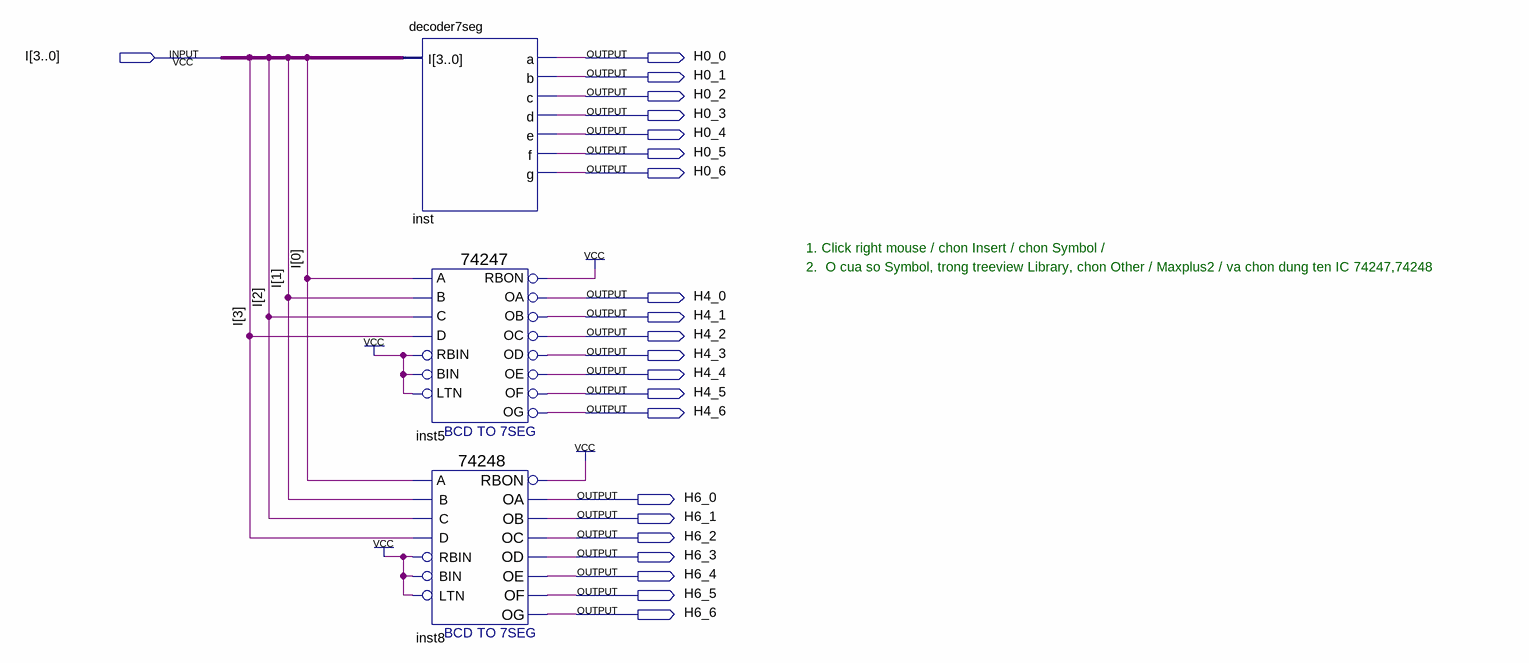
[diagram p0: schematic sheet]
// Quartus schematic topdesign.bdf as structural Verilog: 3 symbols, 22 pins
module topdesign (
  input  [3:0] I,
  output H0_0,
  output H0_1,
  output H0_2,
  output H0_3,
  output H0_4,
  output H0_5,
  output H0_6,
  output H4_0,
  output H4_1,
  output H4_2,
  output H4_3,
  output H4_4,
  output H4_5,
  output H4_6,
  output H6_0,
  output H6_1,
  output H6_2,
  output H6_3,
  output H6_4,
  output H6_5,
  output H6_6
);

  wire inst5_rbon, inst8_rbon;

  decoder7seg inst (.I(I), .a(H0_0), .b(H0_1), .c(H0_2), .d(H0_3), .e(H0_4), .f(H0_5), .g(H0_6));
  \74247  inst5 (
    .LTN(1'b1), .BIN(1'b1), .A(I[0]), .B(I[1]), .RBIN(1'b1), .C(I[2]), .D(I[3]), .OF(H4_5), .OC(H4_2),
    .OD(H4_3), .OE(H4_4), .RBON(inst5_rbon), .OA(H4_0), .OB(H4_1), .OG(H4_6));
  \74248  inst8 (
    .A(I[0]), .B(I[1]), .RBIN(1'b1), .D(I[3]), .C(I[2]), .LTN(1'b1), .BIN(1'b1), .OG(H6_6), .OD(H6_3),
    .OE(H6_4), .OF(H6_5), .OA(H6_0), .OB(H6_1), .OC(H6_2), .RBON(inst8_rbon));
  // also tied to VCC on the sheet: {inst5_rbon, inst8_rbon}

  // Notes on the sheet:
  //   1. Click right mouse / chon Insert / chon Symbol /  
  //   2.  O cua so Symbol, trong treeview Library, chon Other / Maxplus2 / va chon dung ten IC 74247,74248
endmodule
